# Altium schematic sheet DCP.SchDoc
size 209 x 297 mm; Address1: Address1; Address2: Address2; Address3: Address3; Address4: Address4; SheetNumber: 1; Scale: 1:1; Разраб.: Иванов; Обозначение документа: АБВГ.123456.001 Э3; Пров.: Петров; Утв.: Сидоров; Наименование организации: ОАО "Концерн "МПО-Гидроприбор"; Перв. применение: АБВГ.123456.000; Наименование изделия 1: Плата; Наименование изделия 2: Схема электрическая; Наименование изделия 3: принципиальная; Нач. отд.: Нач. отд.; Фамилия нач. отд.: Сидоров
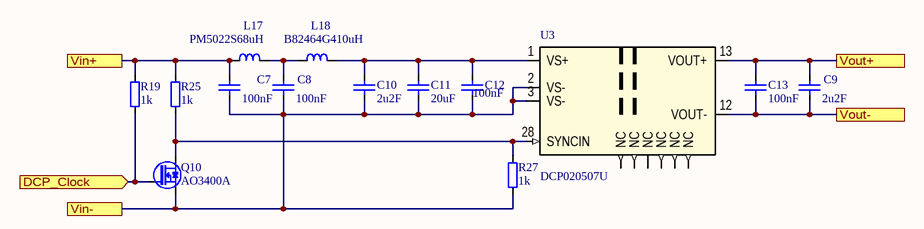
[diagram p0: DCP.SchDoc]

## Parts
C7  100nF  [SMD0805CAP]
C8  100nF  [SMD0805CAP]
C9  2u2F  [SMD0805CAP]
C10  2u2F  [SMD0805CAP]
C11  20uF  [CAPC1206]
C12  100nF  [SMD0805CAP]
C13  100nF  [SMD0805CAP]
L17  PM5022S68uH  [IND_Bourns_PM5022S]
L18  B82464G410uH  [IND_COILCRAFT_MSS1038]
Q10  AO3400A  [SOT95P229X119-3N]
R19  1k  [SMD0805RES]
R25  1k  [SMD0805RES]
R27  1k  [SMD0805RES]
U3  DCP020507U  [SOIC127P1033X265-12_28N]

## Ports
DCP_Clock (in), Vin+, Vin-, Vout+, Vout-

## Nets
DCP_Clock: Q10.1(G) R19.2 ; port DCP_Clock
Vin+: C7.2 L17.1 R19.1 R25.1 ; port Vin+
Vin-: C7.1 C8.1 C10.1 C11.1 C12.1 Q10.2(S) R27.2 U3.2(VS-) U3.3(VS-) ; port Vin-
Vout+: C9.2 C13.2 U3.13(VOUT+) ; port Vout+
Vout-: C9.1 C13.1 U3.12(VOUT-) ; port Vout-
NetC8_2: C8.2 L17.2 L18.1
NetC10_2: C10.2 C11.2 C12.2 L18.2 U3.1(VS+)
NetQ10_3: Q10.3(D) R25.2 R27.1 U3.28(SYNCIN)

Not connected (* = marked no-connect by the designer): U3 14(NC) 15(NC) 16(NC) 17(NC) 26(NC) 27(NC)

## Notes on the sheet
- Перв. примен.
- Справ. №
- Подп. и дата
- Инв. № дубл.
- Взам. инв. №
- Инв. № подл.
- Изм.
- Лист
- № докум.
- Подп.
- Дата
- Копировал
- Формат А4

## Library data of the parts
C7-C10 C12 C13 = C0805: Чип конденсатор 0805; Voltage: 25V; Vendor: Vishay; DielectricType: X5R; SMD Solders: 2; Solder Option: RM; Tolerance: 20%; Pkg: SMD0805; Device: Cap0805; Price: 2
  C7 C8 C12 C13: Value: 100nF
  C9 C10: Value: 2u2F
C11 = C1206: Чип конденсатор 0805; Voltage: 16V; Vendor: Vishay; DielectricType: X5R; SMD Solders: 2; Solder Option: RM; Tolerance: 1%; Pkg: SMD1206; Device: Cap1206; Value: 20uF; Price: 2
L17 = IND_BOURNS_PM5022S: SMD Дроссель; Vendor: Panasonic; Value: 68uH; Voltage: 2; Solder Option: RM; Tolerance: 20%; Pkg: SMD13x13mm; THD Solders: 0; Name to order: PM5022s-680M-RM; Current: 1A6; Price: 400; SMD Solders: 2; Device: PM5022S
L18 = B82464G4: SMD Дроссель; Vendor: Epcos; Value: 10uH; Voltage: 2; Solder Option: RM; Tolerance: 20%; Pkg: SMD10.4x10.4mm; THD Solders: 0; Name to order: B82464G4103M; Current: 3A5; Price: 400; SMD Solders: 2; Device: B82464G4
Q10 = AO3400A: NMOS; Vendor: UMW; Pkg: SOT23; SMD Solders: 3; Solder Option: RM; Voltage: 30V; Price: 10; Device: AO3400A; Name to order: AO3400A
R19 R25 R27 = R0805: Чип резистор 0805; Vendor: Vishay; SMD Solders: 2; Solder Option: RM; TC: 100ppm/C; Tolerance: 1%; Pkg: SMD0805; Pwr: 125mW; Device: Res0805; Price: 2; Value: 1k
U3 = DCP02xxyyU: DC/DC xxV to isolated  yyV; Vendor: Texas Instruments; Value: 0507U; Device: DCP02; Pkg: SOIC28; SMD Solders: 6; Solder Option: RM; Voltage: 7V; Copyright: Copyright (C) 2022 Ultra Librarian. All rights reserved.; Price: 1000